# Altium schematic sheet ETHERNET.SchDoc
size A3; Organization: ICNS, MARCS Institute; Address1: Werrington South Campus, Great Western Highway; Address2: Werrington, NSW, 2747; SheetNumber: 12; SheetTotal: 16
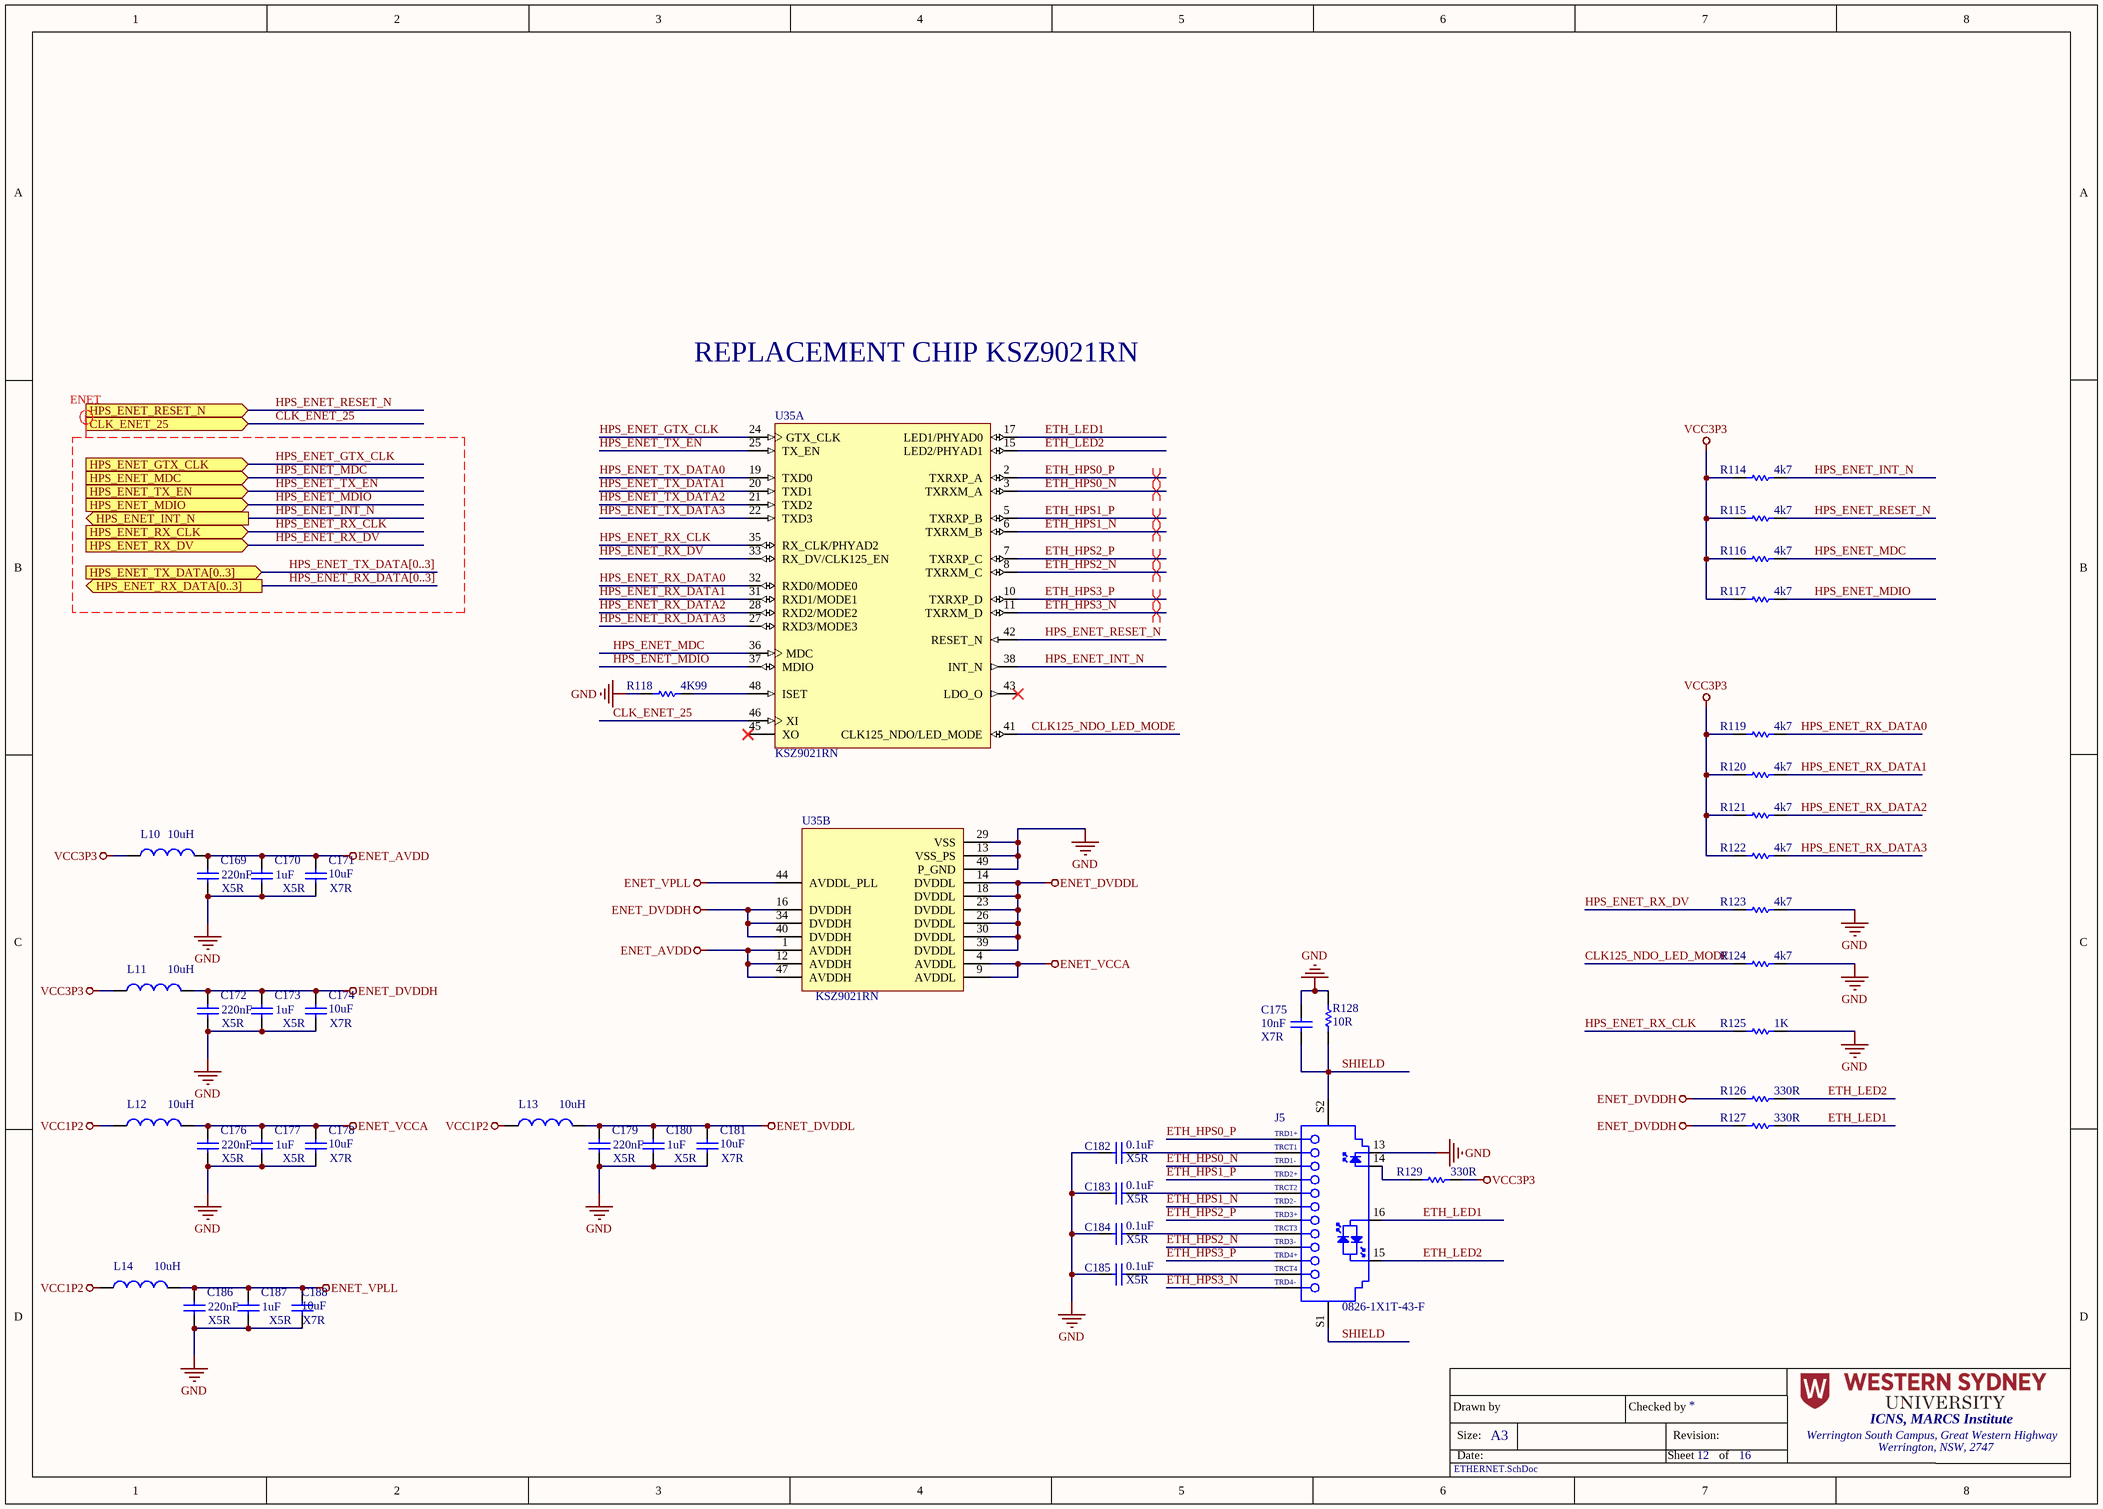
[diagram p0: ETHERNET.SchDoc]

## Parts
C169  value 220nF  Dielectric: X5R  [CAP 0201 (0603)]  (hidden comment: GRM033R61A224KE90D)
C170  value 1uF  Dielectric: X5R  [CAP 0201 (0603)]  (hidden comment: CL03A105KP3NSNC)
C171  value 10uF  Dielectric: X7R  [CAP 0805 (2012)]  (hidden comment: GCM21BR71A106KE22K)
C172  value 220nF  Dielectric: X5R  [CAP 0201 (0603)]  (hidden comment: GRM033R61A224KE90D)
C173  value 1uF  Dielectric: X5R  [CAP 0201 (0603)]  (hidden comment: CL03A105KP3NSNC)
C174  value 10uF  Dielectric: X7R  [CAP 0805 (2012)]  (hidden comment: GCM21BR71A106KE22K)
C175  value 10nF  Dielectric: X7R  [CAP 0201 (0603)]  (hidden comment: GRM033R71A103KA01D)
C176  value 220nF  Dielectric: X5R  [CAP 0201 (0603)]  (hidden comment: GRM033R61A224KE90D)
C177  value 1uF  Dielectric: X5R  [CAP 0201 (0603)]  (hidden comment: CL03A105KP3NSNC)
C178  value 10uF  Dielectric: X7R  [CAP 0805 (2012)]  (hidden comment: GCM21BR71A106KE22K)
C179  value 220nF  Dielectric: X5R  [CAP 0201 (0603)]  (hidden comment: GRM033R61A224KE90D)
C180  value 1uF  Dielectric: X5R  [CAP 0201 (0603)]  (hidden comment: CL03A105KP3NSNC)
C181  value 10uF  Dielectric: X7R  [CAP 0805 (2012)]  (hidden comment: GCM21BR71A106KE22K)
C182  value 0.1uF  Dielectric: X5R  [CAP 0201 (0603)]  (hidden comment: CL03A104KP3NNNC)
C183  value 0.1uF  Dielectric: X5R  [CAP 0201 (0603)]  (hidden comment: CL03A104KP3NNNC)
C184  value 0.1uF  Dielectric: X5R  [CAP 0201 (0603)]  (hidden comment: CL03A104KP3NNNC)
C185  value 0.1uF  Dielectric: X5R  [CAP 0201 (0603)]  (hidden comment: CL03A104KP3NNNC)
C186  value 220nF  Dielectric: X5R  [CAP 0201 (0603)]  (hidden comment: GRM033R61A224KE90D)
C187  value 1uF  Dielectric: X5R  [CAP 0201 (0603)]  (hidden comment: CL03A105KP3NSNC)
C188  value 10uF  Dielectric: X7R  [CAP 0805 (2012)]  (hidden comment: GCM21BR71A106KE22K)
J5  0826-1X1T-43-F  [BEL_0826-1X1T-43-F]
L10  value 10uH  [INDC2012X15N]  (hidden comment: 74479777310)
L11  value 10uH  [INDC2012X15N]  (hidden comment: 74479777310)
L12  value 10uH  [INDC2012X15N]  (hidden comment: 74479777310)
L13  value 10uH  [INDC2012X15N]  (hidden comment: 74479777310)
L14  value 10uH  [INDC2012X15N]  (hidden comment: 74479777310)
R114  value 4k7  [RES 0201 (0603)]  (hidden comment: AC0201FR-074K7L)
R115  value 4k7  [RES 0201 (0603)]  (hidden comment: AC0201FR-074K7L)
R116  value 4k7  [RES 0201 (0603)]  (hidden comment: AC0201FR-074K7L)
R117  value 4k7  [RES 0201 (0603)]  (hidden comment: AC0201FR-074K7L)
R118  value 4K99  [RES 0201 (0603)]  (hidden comment: CRCW02014K99FKED)
R119  value 4k7  [RES 0201 (0603)]  (hidden comment: AC0201FR-074K7L)
R120  value 4k7  [RES 0201 (0603)]  (hidden comment: AC0201FR-074K7L)
R121  value 4k7  [RES 0201 (0603)]  (hidden comment: AC0201FR-074K7L)
R122  value 4k7  [RES 0201 (0603)]  (hidden comment: AC0201FR-074K7L)
R123  value 4k7  [RES 0201 (0603)]  (hidden comment: AC0201FR-074K7L)
R124  value 4k7  [RES 0201 (0603)]  (hidden comment: AC0201FR-074K7L)
R125  value 1K  [RES 0201 (0603)]  (hidden comment: AC0201FR-071KL)
R126  value 330R  [RES 0402 (1005)]  (hidden comment: CRCW0402330RFKEDHP)
R127  value 330R  [RES 0402 (1005)]  (hidden comment: CRCW0402330RFKEDHP)
R128  value 10R  [RES 0402 (1005)]  (hidden comment: CRGP0402F10R)
R129  value 330R  [RES 0402 (1005)]  (hidden comment: CRCW0402330RFKEDHP)
U35  KSZ9021RN  [MICL-VQFN-48-5100x5100TP_V]  (parts A,B of 2)

## Ports
CLK_ENET_25 (in), HPS_ENET_GTX_CLK (in), HPS_ENET_INT_N (out), HPS_ENET_MDC (in), HPS_ENET_MDIO (in), HPS_ENET_RESET_N (in), HPS_ENET_RX_CLK (in), HPS_ENET_RX_DATA[0..3] (out), HPS_ENET_RX_DV (in), HPS_ENET_TX_DATA[0..3] (in), HPS_ENET_TX_EN (in)

## Nets
ENET_AVDD: C169.1 C170.1 C171.1 L10.2 U35.1(AVDDH) U35.12(AVDDH) U35.47(AVDDH)
ENET_DVDDH: C172.1 C173.1 C174.1 L11.2 R126.2 R127.2 U35.16(DVDDH) U35.34(DVDDH) U35.40(DVDDH)
ENET_DVDDL: C179.1 C180.1 C181.1 L13.2 U35.14(DVDDL) U35.18(DVDDL) U35.23(DVDDL) U35.26(DVDDL) U35.30(DVDDL) U35.39(DVDDL)
ENET_VCCA: C176.1 C177.1 C178.1 L12.2 U35.4(AVDDL) U35.9(AVDDL)
ENET_VPLL: C186.1 C187.1 C188.1 L14.2 U35.44(AVDDL_PLL)
GND: C169.2 C170.2 C171.2 C172.2 C173.2 C174.2 C175.1 C176.2 C177.2 C178.2 C179.2 C180.2 C181.2 C182.1 C183.1 C184.1 C185.1 C186.2 C187.2 C188.2 J5.13 R118.2 R123.2 R124.2 R125.2 R128.1 U35.13(VSS_PS) U35.29(VSS) U35.49(P_GND)
VCC1P2: L12.1 L13.1 L14.1
VCC3P3: L10.1 L11.1 R114.1 R115.1 R116.1 R117.1 R119.1 R120.1 R121.1 R122.1 R129.1
CLK125_NDO_LED_MODE: R124.1 U35.41(CLK125_NDO/LED_MODE)
CLK_ENET_25: U35.46(XI) ; port CLK_ENET_25
ETH_HPS0_N: J5.10(TRD1-) U35.3(TXRXM_A)
ETH_HPS0_P: J5.11(TRD1+) U35.2(TXRXP_A)
ETH_HPS1_N: J5.5(TRD2-) U35.6(TXRXM_B)
ETH_HPS1_P: J5.4(TRD2+) U35.5(TXRXP_B)
ETH_HPS2_N: J5.2(TRD3-) U35.8(TXRXM_C)
ETH_HPS2_P: J5.3(TRD3+) U35.7(TXRXP_C)
ETH_HPS3_N: J5.9(TRD4-) U35.11(TXRXM_D)
ETH_HPS3_P: J5.8(TRD4+) U35.10(TXRXP_D)
ETH_LED1: J5.16 R127.1 U35.17(LED1/PHYAD0)
ETH_LED2: J5.15 R126.1 U35.15(LED2/PHYAD1)
HPS_ENET_GTX_CLK: U35.24(GTX_CLK) ; port HPS_ENET_GTX_CLK
HPS_ENET_INT_N: R114.2 U35.38(INT_N) ; port HPS_ENET_INT_N
HPS_ENET_MDC: R116.2 U35.36(MDC) ; port HPS_ENET_MDC
HPS_ENET_MDIO: R117.2 U35.37(MDIO) ; port HPS_ENET_MDIO
HPS_ENET_RESET_N: R115.2 U35.42(RESET_N) ; port HPS_ENET_RESET_N
HPS_ENET_RX_CLK: R125.1 U35.35(RX_CLK/PHYAD2) ; port HPS_ENET_RX_CLK
HPS_ENET_RX_DATA0: R119.2 U35.32(RXD0/MODE0)
HPS_ENET_RX_DATA1: R120.2 U35.31(RXD1/MODE1)
HPS_ENET_RX_DATA2: R121.2 U35.28(RXD2/MODE2)
HPS_ENET_RX_DATA3: R122.2 U35.27(RXD3/MODE3)
HPS_ENET_RX_DV: R123.1 U35.33(RX_DV/CLK125_EN) ; port HPS_ENET_RX_DV
HPS_ENET_TX_DATA0: U35.19(TXD0)
HPS_ENET_TX_DATA1: U35.20(TXD1)
HPS_ENET_TX_DATA2: U35.21(TXD2)
HPS_ENET_TX_DATA3: U35.22(TXD3)
HPS_ENET_TX_EN: U35.25(TX_EN) ; port HPS_ENET_TX_EN
SHIELD: C175.2 J5.S1 J5.S2 R128.2
NetC182_2: C182.2 J5.12(TRCT1)
NetC183_2: C183.2 J5.6(TRCT2)
NetC184_2: C184.2 J5.1(TRCT3)
NetC185_2: C185.2 J5.7(TRCT4)
NetJ5_14: J5.14 R129.2
NetR118_1: R118.1 U35.48(ISET)

Not connected (* = marked no-connect by the designer): U35 43(LDO_O)* 45(XO)*

## Buses and harness runs
bus HPS_ENET_RX_DATA[0..3] = port HPS_ENET_RX_DATA[0..3]
bus HPS_ENET_TX_DATA[0..3] = port HPS_ENET_TX_DATA[0..3]

## Layout directives
differential pair; net class DIGITAL; differential pair class ETH_HPS0: ETH_HPS0_N, ETH_HPS0_P
differential pair; net class DIGITAL; differential pair class ETH_HPS1: ETH_HPS1_N, ETH_HPS1_P
differential pair; net class DIGITAL; differential pair class ETH_HPS2: ETH_HPS2_N, ETH_HPS2_P
differential pair; net class DIGITAL; differential pair class ETH_HPS3: ETH_HPS3_N, ETH_HPS3_P
net class ENET: HPS_ENET_GTX_CLK, HPS_ENET_INT_N, HPS_ENET_MDC, HPS_ENET_MDIO, HPS_ENET_RX_CLK, HPS_ENET_RX_DATA[0..3], HPS_ENET_RX_DV, HPS_ENET_TX_DATA[0..3], HPS_ENET_TX_EN

## Notes on the sheet
- REPLACEMENT CHIP KSZ9021RN
- Drawn by
- Size:
- Date:
- A3
- Checked by
- Sheet
- Revision:
- of

## Library data of the parts
C169 C172 C176 C179 C186 = CMP-003-000020-1: Cap Multilayer Ceramic 220nF 10V X5R 0201 ±10% Tolerance; Manufacturer: Murata; Stock 1: 391; Pricing 1: 1=0.10000, 10=0.03600, 50=0.01980, 100=0.01620, 500=0.01156, 1000=0.00908, 2500=0.00825, 5000=0.00759 (USD); RoHS: Yes; Mount: Surface Mount; Case/Package: 0201; Case Code (Metric): 0603; Case Code (Imperial): 0201; Min Operating Temperature: -55°C; Max Operating Temperature: 85°C; Tolerance: 10%; Packaging: Tape and Reel; Capacitance: 220nF; Voltage Rating: 10V; Length: 0.024inch; Width: 0.012inch; Thickness: 0.013inch; ComponentLink1URL: http://www.farnell.com/datasheets/2867835.pdf?src-supplier=Farnell; ComponentLink1Description: http://www.farnell.com/datasheets/2867835.pdf?src-supplier=Farnell; ComponentLink2URL: http://www.mouser.com/ds/2/281/c02e-2905.pdf?src-supplier=Mouser; ComponentLink2Description: http://www.mouser.com/ds/2/281/c02e-2905.pdf?src-supplier=Mouser; ComponentLink3URL: http://search.murata.co.jp/Ceramy/image/img/A01X/G101/ENG/GRM033R61A224KE90-01.pdf?src-supplier=Digi-Key; Manufacturer Part Number: GRM033R61A224KE90D; Category: Ceramic Capacitors; ComponentLink4Description: http://www.farnell.com/datasheets/2867835.pdf?src-supplier=Newark; ComponentLink3Description: http://search.murata.co.jp/Ceramy/image/img/A01X/G101/ENG/GRM033R61A224KE90-01.pdf?src-supplier=Digi-Key; Design Item ID: GRM033R61A224KE90D; RoHS Compliant: Yes; ComponentLink4URL: http://www.farnell.com/datasheets/2867835.pdf?src-supplier=Newark; Voltage Rating (DC): 10V; Source: ICNS_PropheseeLib.SchLib
C170 C173 C177 C180 C187 = CMP-003-000015-1: Cap Ceramic 1uF 10V X5R 10% Pad SMD 0201 85C T/R; Manufacturer: Samsung; Stock 1: 3449211; Pricing 1: 10000=0.06202, 20000=0.05883 (USD); RoHS: Yes; Mount: Surface Mount; Case/Package: 0201; Case Code (Metric): 0603; Case Code (Imperial): 0201; Min Operating Temperature: -55°C; Max Operating Temperature: 85°C; Tolerance: 10%; Packaging: Cut Tape; Capacitance: 1uF; Voltage Rating: 10V; Length: 0.024inch; Width: 0.012inch; Thickness: 0.013inch; ComponentLink1URL: http://www.samsungsem.com/kr/support/product-search/mlcc/CL03A105KP3NSNC.jsp?src-supplier=Digi-Key; ComponentLink1Description: http://www.samsungsem.com/kr/support/product-search/mlcc/CL03A105KP3NSNC.jsp?src-supplier=Digi-Key; RoHS Compliant: Yes; Design Item ID: CL03A105KP3NSNC; Manufacturer Part Number: CL03A105KP3NSNC; Source: ICNS_PropheseeLib.SchLib; Category: Ceramic Capacitors
C171 C174 C178 C181 C188 = CMP-003-000011-1: 0805 10 uF 10 V ±10 % Tolerance X7R Surface Mount Multilayer Ceramic Capacitor; Manufacturer: Murata; Tolerance: 10%; Voltage Rating: 10V; RoHS: Yes; Mount: Surface Mount; Case/Package: 0805; Case Code (Metric): 2012; Case Code (Imperial): 0805; Min Operating Temperature: -55°C; Max Operating Temperature: 125°C; Packaging: Tape and Reel; Package Quantity: 10000; Capacitance: 10uF; Length: 0.079inch; Height: 1.25mm; Width: 1.25mm; Thickness: 0.055inch; ComponentLink1URL: http://www.mouser.com/ds/2/281/c03e-806517.pdf?src-supplier=Mouser; ComponentLink1Description: http://www.mouser.com/ds/2/281/c03e-806517.pdf?src-supplier=Mouser; ComponentLink2URL: https://search.murata.co.jp/Ceramy/image/img/A01X/G101/ENG/GCM21BR71A106KE22-01.pdf?src-supplier=Digi-Key; ComponentLink2Description: https://search.murata.co.jp/Ceramy/image/img/A01X/G101/ENG/GCM21BR71A106KE22-01.pdf?src-supplier=Digi-Key; Category: Ceramic Capacitors; Design Item ID: GCM21BR71A106KE22K; Voltage Rating (DC): 10V; Ratings: AEC-Q200; ComponentLink3URL: http://search.murata.co.jp/Ceramy/image/img/A01X/partnumbering_e_02.pdf?src-supplier=Digi-Key; Weight: 0.000335oz; ComponentLink4Description: http://search.murata.co.jp/Ceramy/image/img/A01X/G101/ENG/GCM21BR71A106KE22-01.pdf?src-supplier=Digi-Key; RoHS Compliant: Yes; Manufacturer Part Number: GCM21BR71A106KE22K; Source: ICNS_PropheseeLib.SchLib; Pricing: 1=0.45000, 10=0.31600, 50=0.23880, 100=0.20790, 500=0.15400, 1000=0.13090, 2500=0.12320, 5000=0.11550 (USD); Stock: 4655; ComponentLink4URL: http://search.murata.co.jp/Ceramy/image/img/A01X/G101/ENG/GCM21BR71A106KE22-01.pdf?src-supplier=Digi-Key; Termination: SMD/SMT; ComponentLink3Description: http://search.murata.co.jp/Ceramy/image/img/A01X/partnumbering_e_02.pdf?src-supplier=Digi-Key
C175 = CMP-003-000022-2: Cap Multilayer Ceramic 10nF 10V X7R 0201 ±10 % Tolerance SMT; Manufacturer: Murata; Tolerance: 10%; Stock 1: 6245; Pricing 1: 1=0.10000, 10=0.02000, 50=0.01060, 100=0.00870, 500=0.00624, 1000=0.00490, 2500=0.00446, 5000=0.00410 (USD); RoHS: Yes; Mount: Surface Mount; Case/Package: 0201; Case Code (Metric): 0603; Case Code (Imperial): 0201; Min Operating Temperature: -55°C; Max Operating Temperature: 125°C; Packaging: Tape and Reel; Package Quantity: 1; Capacitance: 10nF; Voltage Rating: 10V; Length: 0.6mm; Height: 0.3mm; Width: 0.012inch; Thickness: 0.013inch; Depth: 0.3mm; Radiation Hardening: No; ComponentLink1URL: https://datasheet.ciiva.com/129/grm033r71a103ka01-01-129814.pdf?src-supplier=Digi-Key; ComponentLink1Description: https://datasheet.ciiva.com/129/grm033r71a103ka01-01-129814.pdf?src-supplier=Digi-Key; ComponentLink2URL: https://datasheet.ciiva.com/129/grm033r71a103ka01-01-129815.pdf?src-supplier=Digi-Key; ComponentLink2Description: https://datasheet.ciiva.com/129/grm033r71a103ka01-01-129815.pdf?src-supplier=Digi-Key; Voltage: 10V; Design Item ID: GRM033R71A103KA01D; ComponentLink3URL: https://datasheet.ciiva.com/11789/0900766b80ef921d-11789049.pdf?src-supplier=RSComponents; Source: ICNS_PropheseeLib.SchLib; Voltage Rating (DC): 10V; ComponentLink4URL: https://datasheet.ciiva.com/16467/product-16467346.pdf?src-supplier=Future+Electronics; REACH SVHC: No SVHC; RoHS Compliant: Yes; Lead Free: Lead Free; ComponentLink3Description: https://datasheet.ciiva.com/11789/0900766b80ef921d-11789049.pdf?src-supplier=RSComponents; ComponentLink5URL: https://datasheet.ciiva.com/18184/getdatasheetpartid-158821-18184066.pdf?src-supplier=Verical; Termination: SMD/SMT; Material: Ceramic; ComponentLink7Description: https://datasheet.ciiva.com/5422/product-5422667.pdf?src-supplier=Mouser; Manufacturer Part Number: GRM033R71A103KA01D; ComponentLink5Description: https://datasheet.ciiva.com/18184/getdatasheetpartid-158821-18184066.pdf?src-supplier=Verical; ComponentLink7URL: https://datasheet.ciiva.com/5422/product-5422667.pdf?src-supplier=Mouser; Category: Ceramic Capacitors; ComponentLink6URL: https://datasheet.ciiva.com/29199/455719-da-01-en-vs-kondensator-0201-29199284.pdf?src-supplier=Conrad; ComponentLink4Description: https://datasheet.ciiva.com/16467/product-16467346.pdf?src-supplier=Future+Electronics; ComponentLink6Description: https://datasheet.ciiva.com/29199/455719-da-01-en-vs-kondensator-0201-29199284.pdf?src-supplier=Conrad
C182-C185 = CMP-003-000014-1: Cap Ceramic 0.1uF 10V X5R 10% Pad SMD 0201 85C T/R; Manufacturer: Samsung; Capacitance: 100nF; Stock 1: 12175; Pricing 1: 1=0.10000, 10=0.02900, 50=0.01600, 100=0.01300, 500=0.00932, 1000=0.00732, 2500=0.00666, 5000=0.00612 (USD); RoHS: Yes; Mount: Surface Mount; Case/Package: 0201; Case Code (Metric): 0603; Case Code (Imperial): 0201; Contact Plating: Tin; Min Operating Temperature: -55°C; Max Operating Temperature: 85°C; Tolerance: 10%; Packaging: Tape and Reel; Package Quantity: 1; Voltage Rating: 10V; Length: 0.6mm; Height: 0.3mm; Width: 0.012inch; Thickness: 0.013inch; Depth: 0.3mm; Radiation Hardening: No; ComponentLink1URL: https://datasheet.ciiva.com/25803/cl03a104kp3nnnc-25803204.pdf?src-supplier=Digi-Key; ComponentLink1Description: https://datasheet.ciiva.com/25803/cl03a104kp3nnnc-25803204.pdf?src-supplier=Digi-Key; ComponentLink2URL: https://datasheet.ciiva.com/26838/getdatasheetpartid-357484-26838083.pdf?src-supplier=Verical; ComponentLink2Description: https://datasheet.ciiva.com/26838/getdatasheetpartid-357484-26838083.pdf?src-supplier=Verical; Source: ICNS_PropheseeLib.SchLib; Manufacturer Part Number: CL03A104KP3NNNC; Lead Free: Lead Free; Series: CL; Design Item ID: CL03A104KP3NNNC; Voltage Rating (DC): 10V; Category: Ceramic Capacitors; Construction: Flat
J5 = CMP-010-000017-1: Conn Modular Jack RCP 12 POS 2.03mm Solder RA Thru-Hole 16 Terminal 1 Port Tray; Manufacturer: Bel; Number of Ports: 1; Shielding: Shielded; Direction: Up; Number of Positions Loaded: 12; Connector Type: RJ45; Gender: Female; Number of Cores per Jack: 8; Mount: Through Hole; ComponentLink1Description: https://datasheet.ciiva.com/688/0826-1x1t-43-f-688148.pdf?src-supplier=Digi-Key; Package Quantity: 40; Packaging: Tray; Length: 19.15mm; ComponentLink2URL: https://datasheet.ciiva.com/688/0826-1x1t-43-f-688148.pdf?src-supplier=Avnet; ComponentLink1URL: https://datasheet.ciiva.com/688/0826-1x1t-43-f-688148.pdf?src-supplier=Digi-Key; ComponentLink2Description: https://datasheet.ciiva.com/688/0826-1x1t-43-f-688148.pdf?src-supplier=Avnet; Pitch: 2.03mm; Design Item ID: 0826-1X1T-43-F; Termination: Solder; Series: MagJack®; Depth: 15.01mm; Manufacturer Part Number: 0826-1X1T-43-F; Orientation: Right Angle; Stock 1: 240; Source: ICNS_PropheseeLib.SchLib; RoHS: Yes; Housing Material: Polyamide; Pricing 1: 1=6.42000, 10=6.30000, 25=6.18000, 50=5.69000, 100=5.45000, 250=5.21000, 500=4.72000 (USD); Category: Modular / Ethernet Connectors; Number of Rows: 1; Color: Green,Orange,Yellow; Contact Plating: Gold; Number of Contacts: 12
L10-L14 = CMP-005-000002-1: Inductor WE-PMI Series 10 µH; Multilayer SMD ; 0805 Case; 25MHz Q: 35 650mA 500mO; Manufacturer: Wurth Electronics; Inductance Tolerance: 20%; Core Material: Nickel Zinc Ferrite (NiZn); Test Frequency: 1MHz; DC Resistance (DCR): 625mR; Saturation Rating: 125mA; ComponentLink2URL: http://www.farnell.com/datasheets/2618711.pdf?src-supplier=Newark; ComponentLink2Description: http://www.farnell.com/datasheets/2618711.pdf?src-supplier=Newark; ComponentLink1Description: http://www.farnell.com/datasheets/2618711.pdf?src-supplier=Farnell; Inductance: 10uH; ComponentLink1URL: http://www.farnell.com/datasheets/2618711.pdf?src-supplier=Farnell; Current Rating: 650mA; Design Item ID: 74479777310; Stock 1: 800; Category: Fixed Inductors; Manufacturer Part Number: 74479777310; RoHS Compliant: Yes; RoHS: Yes; Source: ICNS_PropheseeLib.SchLib; Case/Package: SMD/SMT; Pricing 1: 10=1.37800, 500=0.87800 (USD)
R114-R117 R119-R124 = CMP-006-000022-1: Res Thick Film 0201 4.7K Ohm 1% 1/20W ±200ppm/°C Molded SMD Paper T/R; Manufacturer: Yageo; Resistance: 4.7kR; Max Power Dissipation: 50mW; Max Operating Temperature: 155°C; Tolerance: 1%; Height: 0.01inch; Width: 0.012inch; Case/Package: 0201; Min Operating Temperature: -55°C; Temperature Coefficient: 200ppm/°C; Length: 0.024inch; Packaging: Tape and Reel; Case Code (Imperial): 0201; Number of Terminations: 2; RoHS: Yes; Case Code (Metric): 0603; Features: Moisture Resistant,Automotive AEC-Q200; Source: ICNS_PropheseeLib.SchLib; Pricing 1: 1=0.10000, 10=0.06600, 100=0.02670, 1000=0.01201, 2500=0.01042, 5000=0.00861 (USD); Stock 1: 267560; ComponentLink1URL: http://www.yageo.com/NewPortal/yageodocoutput?fileName=/pdf/R-Chip/PYu-AC_51_RoHS_L_6.pdf&src-supplier=Digi-Key; Manufacturer Part Number: AC0201FR-074K7L; Lead Free: Lead Free; ComponentLink1Description: http://www.yageo.com/NewPortal/yageodocoutput?fileName=/pdf/R-Chip/PYu-AC_51_RoHS_L_6.pdf&src-supplier=Digi-Key; Design Item ID: AC0201FR-074K7L; Category: Chip SMD Resistors; Resistor Type: Thick Film
R118 = CMP-006-000048-1: Res Thick Film 0201 4.99K Ohm 1% 1/20W ±100ppm/°C Molded SMD SMD Paper T/R; Manufacturer: Vishay Dale; Max Power Dissipation: 50mW; Voltage Rating (DC): 30V; RoHS: Yes; Case/Package: 0201; Case Code (Metric): 0603; Case Code (Imperial): 0201; Min Operating Temperature: -55°C; Max Operating Temperature: 155°C; Tolerance: 1%; Number of Terminations: 2; Temperature Coefficient: 100ppm/°C; Width: 0.3mm; ComponentLink1URL: https://datasheet.ciiva.com/2473/crcw0201e3-2473662.pdf?src-supplier=Digi-Key; ComponentLink1Description: https://datasheet.ciiva.com/2473/crcw0201e3-2473662.pdf?src-supplier=Digi-Key; ComponentLink2URL: https://datasheet.ciiva.com/2473/crcw0201e3-2473663.pdf?src-supplier=Digi-Key; ComponentLink2Description: https://datasheet.ciiva.com/2473/crcw0201e3-2473663.pdf?src-supplier=Digi-Key; ComponentLink3URL: https://datasheet.ciiva.com/9069/crcw0201e3-9069286.pdf?src-supplier=Avnet; ComponentLink3Description: https://datasheet.ciiva.com/9069/crcw0201e3-9069286.pdf?src-supplier=Avnet; Stock 1: 38253; Pricing 1: 1=0.28000, 10=0.24000, 100=0.09400, 1000=0.03933, 2500=0.03605, 5000=0.03278 (USD); Contact Plating: Tin; Termination: SMD/SMT; Package Quantity: 1; Resistance: 4.99K; Power Rating: 50mW; Packaging: Tape and Reel; Length: 0.6mm; Height: 0.23mm; Lead Free: Lead Free; ComponentLink4URL: https://datasheet.ciiva.com/2473/crcw0201e3-2473661.pdf?src-supplier=Digi-Key; ComponentLink4Description: https://datasheet.ciiva.com/2473/crcw0201e3-2473661.pdf?src-supplier=Digi-Key; Series: CRCW; Weight: 6E-06oz; Resistor Type: Thick Film; RoHS Compliant: Yes; Source: ICNS_PropheseeLib.SchLib; Category: Chip SMD Resistors; Design Item ID: CRCW02014K99FKED; Manufacturer Part Number: CRCW02014K99FKED; Voltage Rating: 30V; Depth: 0.3mm; Number of Pins: 2; Resistance Tolerance: 1%; Technology: THICK FILM; REACH SVHC: Unknown
R125 = CMP-006-000019-1: Res Thick Film 0201 1K Ohm 1% 0.05W(1/20W) ±200ppm/C Pad SMD Automotive T/R; Manufacturer: Yageo; Resistance: 1kR; Temperature Coefficient: 200ppm/°C; Max Power Dissipation: 50mW; Max Operating Temperature: 155°C; Tolerance: 1%; Height: 0.01inch; Width: 0.012inch; Case/Package: 0201; Min Operating Temperature: -55°C; Length: 0.024inch; Packaging: Tape and Reel; Case Code (Imperial): 0201; Number of Terminations: 2; RoHS: Yes; Case Code (Metric): 0603; Features: Moisture Resistant,Automotive AEC-Q200; Source: ICNS_PropheseeLib.SchLib; Pricing 1: 1=0.10000, 10=0.06600, 100=0.02670, 1000=0.01201, 2500=0.01042, 5000=0.00861 (USD); Stock 1: 200; ComponentLink1URL: http://www.yageo.com/NewPortal/yageodocoutput?fileName=/pdf/R-Chip/PYu-AC_51_RoHS_L_6.pdf&src-supplier=Digi-Key; Manufacturer Part Number: AC0201FR-071KL; ComponentLink1Description: http://www.yageo.com/NewPortal/yageodocoutput?fileName=/pdf/R-Chip/PYu-AC_51_RoHS_L_6.pdf&src-supplier=Digi-Key; Design Item ID: AC0201FR-071KL; Category: Chip SMD Resistors; Resistor Type: Thick Film
R126 R127 = CMP-006-000013-1: Res Thick Film 0402 330 Ohm 1% 0.2W ±100ppm/°C Molded SMD SMD Paper T/R; Manufacturer 1: Vishay Dale; Max Power Dissipation: 200mW; Voltage Rating (DC): 50V; Power Rating: 125mW; RoHS: Yes; Case/Package: 0402; Case Code (Metric): 1005; Case Code (Imperial): 0402; Min Operating Temperature: -55°C; Max Operating Temperature: 155°C; Tolerance: 1%; Number of Terminations: 2; Temperature Coefficient: 100ppm/°C; Width: 0.02inch; ComponentLink1URL: https://datasheet.ciiva.com/2573/crcwhpe3-2573979.pdf?src-supplier=Digi-Key; ComponentLink1Description: https://datasheet.ciiva.com/2573/crcwhpe3-2573979.pdf?src-supplier=Digi-Key; Stock 1: 5573; Pricing 1: 10000=0.01543 (USD); Features: Automotive AEC-Q200; Resistance: 330R; Packaging: Tape and Reel; Length: 1mm; Height: 0.016inch; Lead Free: Lead Free; Source: ICNS_PropheseeLib.SchLib; Design Item ID: CRCW0402330RFKEDHP; Category: Chip SMD Resistors; Resistor Type: Thick Film; Depth: 0.5mm; Resistance Tolerance: 1%; Military Standard: Not; Manufacturer Part Number 1: CRCW0402330RFKEDHP; Number of Pins: 2; Radiation Hardening: No; ComponentLink2URL: https://datasheet.ciiva.com/8944/crcwhpe3-8944953.pdf?src-supplier=Avnet; Series: CRCW-HP; Technology: THICK FILM; Package Quantity: 10000; Construction: Rectangular; Mount: Surface Mount; Termination: SMD/SMT; REACH SVHC: Unknown; ComponentLink2Description: https://datasheet.ciiva.com/8944/crcwhpe3-8944953.pdf?src-supplier=Avnet; Description 1: Res Thick Film 0402 330 Ohm 1% 0.2W ±100ppm/°C Molded SMD SMD Paper T/R; Voltage Rating: 50V; RoHS Compliant: Yes; Contact Plating: Tin
R128 = CMP-006-000051-2: Res Thick Film 0402 10 Ohm 1% 0.125W(1/8W) ±100ppm/C Pad SMD T/R; Manufacturer: TE Connectivity; Max Power Dissipation: 125mW; Temperature Coefficient: 100ppm/°C; RoHS: Yes; Case/Package: 0402; Case Code (Metric): 1005; Case Code (Imperial): 0402; Min Operating Temperature: -55°C; Max Operating Temperature: 155°C; Tolerance: 1%; Number of Terminations: 2; ComponentLink1URL: https://4donline.ihs.com/images/VipMasterIC/IC/TYEL/TYEL-S-A0005460475/TYEL-S-A0005460475-1.pdf?hkey=52A5661711E402568146F3353EA87419&src-supplier=Farnell; ComponentLink1Description: https://4donline.ihs.com/images/VipMasterIC/IC/TYEL/TYEL-S-A0005460475/TYEL-S-A0005460475-1.pdf?hkey=52A5661711E402568146F3353EA87419&src-supplier=Farnell; ComponentLink2URL: https://www.te.com/commerce/DocumentDelivery/DDEController?Action=srchrtrv&amp;DocNm=9-1773463-9&amp;DocType=DS&amp;DocLang=English&src-supplier=Digi-Key; ComponentLink2Description: https://www.te.com/commerce/DocumentDelivery/DDEController?Action=srchrtrv&amp;DocNm=9-1773463-9&amp;DocType=DS&amp;DocLang=English&src-supplier=Digi-Key; ComponentLink3URL: https://www.te.com/commerce/DocumentDelivery/DDEController?Action=srchrtrv&DocNm=9-1773463-9&DocType=DS&DocLang=English&src-supplier=Digi-Key; ComponentLink3Description: https://www.te.com/commerce/DocumentDelivery/DDEController?Action=srchrtrv&DocNm=9-1773463-9&DocType=DS&DocLang=English&src-supplier=Digi-Key; Stock 1: 9690; Pricing 1: 1=0.01400, 25=0.01400, 100=0.01400, 250=0.01400, 500=0.01400, 1000=0.01300 (USD); Resistance: 10R; Packaging: Tape and Reel; ComponentLink4URL: https://4donline.ihs.com/images/VipMasterIC/IC/TYEL/TYEL-S-A0005460475/TYEL-S-A0005460475-1.pdf?hkey=52A5661711E402568146F3353EA87419&src-supplier=Newark; ComponentLink4Description: https://4donline.ihs.com/images/VipMasterIC/IC/TYEL/TYEL-S-A0005460475/TYEL-S-A0005460475-1.pdf?hkey=52A5661711E402568146F3353EA87419&src-supplier=Newark; Category: Chip SMD Resistors; Source: ICNS_PropheseeLib.SchLib; Manufacturer Part Number: CRGP0402F10R; RoHS Compliant: Yes; Resistor Type: Thick Film; Design Item ID: CRGP0402F10R
R129 = CMP-006-000013-1: Res Thick Film 0402 330 Ohm 1% 0.2W ±100ppm/°C Molded SMD SMD Paper T/R; Manufacturer 1: Vishay Dale; Max Power Dissipation: 200mW; Power Rating: 125mW; Voltage Rating: 50V; RoHS: Yes; Mount: Surface Mount; Case/Package: 0402; Case Code (Metric): 1005; Case Code (Imperial): 0402; Min Operating Temperature: -55°C; Max Operating Temperature: 155°C; Tolerance: 1%; Number of Terminations: 2; Temperature Coefficient: 100ppm/°C; Width: 0.02inch; ComponentLink1URL: https://datasheet.ciiva.com/2573/crcwhpe3-2573979.pdf?src-supplier=Digi-Key; ComponentLink1Description: https://datasheet.ciiva.com/2573/crcwhpe3-2573979.pdf?src-supplier=Digi-Key; ComponentLink2URL: https://datasheet.ciiva.com/8944/crcwhpe3-8944953.pdf?src-supplier=Avnet; ComponentLink2Description: https://datasheet.ciiva.com/8944/crcwhpe3-8944953.pdf?src-supplier=Avnet; Manufacturer Part Number 1: CRCW0402330RFKEDHP; Stock 1: 5573; Pricing 1: 10000=0.01543 (USD); Contact Plating: Tin; Features: Automotive AEC-Q200; Resistance: 330R; Packaging: Tape and Reel; Package Quantity: 10000; Termination: SMD/SMT; Military Standard: Not; Voltage Rating (DC): 50V; Length: 1mm; Height: 0.016inch; Depth: 0.5mm; Radiation Hardening: No; REACH SVHC: Unknown; Lead Free: Lead Free; Resistance Tolerance: 1%; Category: Chip SMD Resistors; Design Item ID: CRCW0402330RFKEDHP; Number of Pins: 2; Series: CRCW-HP; Technology: THICK FILM; Construction: Rectangular; Resistor Type: Thick Film; Description 1: Res Thick Film 0402 330 Ohm 1% 0.2W ±100ppm/°C Molded SMD SMD Paper T/R; RoHS Compliant: Yes; Source: ICNS_PropheseeLib.SchLib
U35 = CMP-008-000019-1: Ethernet TXRX Single Chip 1-Port 1.2V 10Mbps/100Mbps/1000Mbps 48-Pin QFN EP; Manufacturer: Microchip; Simplex/Duplex: Full Duplex; Min Supply Voltage: 2.375V; Number of Channels: 1; Max Supply Current: 563mA; Max Supply Voltage: 3.465V; Packaging: Tray; Package Quantity: 260; ComponentLink2Description: https://datasheet.ciiva.com/1141/1233924-1141803.pdf?src-supplier=Element14; ComponentLink4URL: https://datasheet.ciiva.com/16350/ksz9021rl-rn-ds-16350878.pdf?src-supplier=Future+Electronics; Category: Ethernet Interface ICs; Series: -; Stock 1: 140; ComponentLink1URL: https://datasheet.ciiva.com/1151/ksz9021rn-pb-1151070.pdf?src-supplier=Newark; RoHS Compliant: Yes; ComponentLink2URL: https://datasheet.ciiva.com/1141/1233924-1141803.pdf?src-supplier=Element14; ComponentLink3Description: https://datasheet.ciiva.com/1766/ksz9021rl-rn-ds-1766631.pdf?src-supplier=Digi-Key; Max Operating Temperature: 70°C; Mount: Surface Mount; Length: 7mm; ComponentLink4Description: https://datasheet.ciiva.com/16350/ksz9021rl-rn-ds-16350878.pdf?src-supplier=Future+Electronics; Number of Functions: 1; Min Operating Temperature: 0°C; ComponentLink1Description: https://datasheet.ciiva.com/1151/ksz9021rn-pb-1151070.pdf?src-supplier=Newark; REACH SVHC: No SVHC; Width: 7mm; Radiation Hardening: No; Design Item ID: KSZ9021RN; Number of Transceivers: 1; Supply Voltage-Nom: 3.465V; Source: ICNS_PropheseeLib.SchLib; Number of Pins: 48; Number of Receivers: 1; Manufacturer Part Number: KSZ9021RN; Data Rate: 1000Mbps; Lead Free: Lead Free; Pricing 1: 1=3.92240, 261=3.83230 (USD); ComponentLink3URL: https://datasheet.ciiva.com/1766/ksz9021rl-rn-ds-1766631.pdf?src-supplier=Digi-Key; Case/Package: QFN; RoHS: Yes